# Altium schematic sheet STM32.SchDoc
size 304 x 190 mm; Engineer: Morgan Jones; Revision: 1.0; SheetNumber: 3; SheetTotal: 3
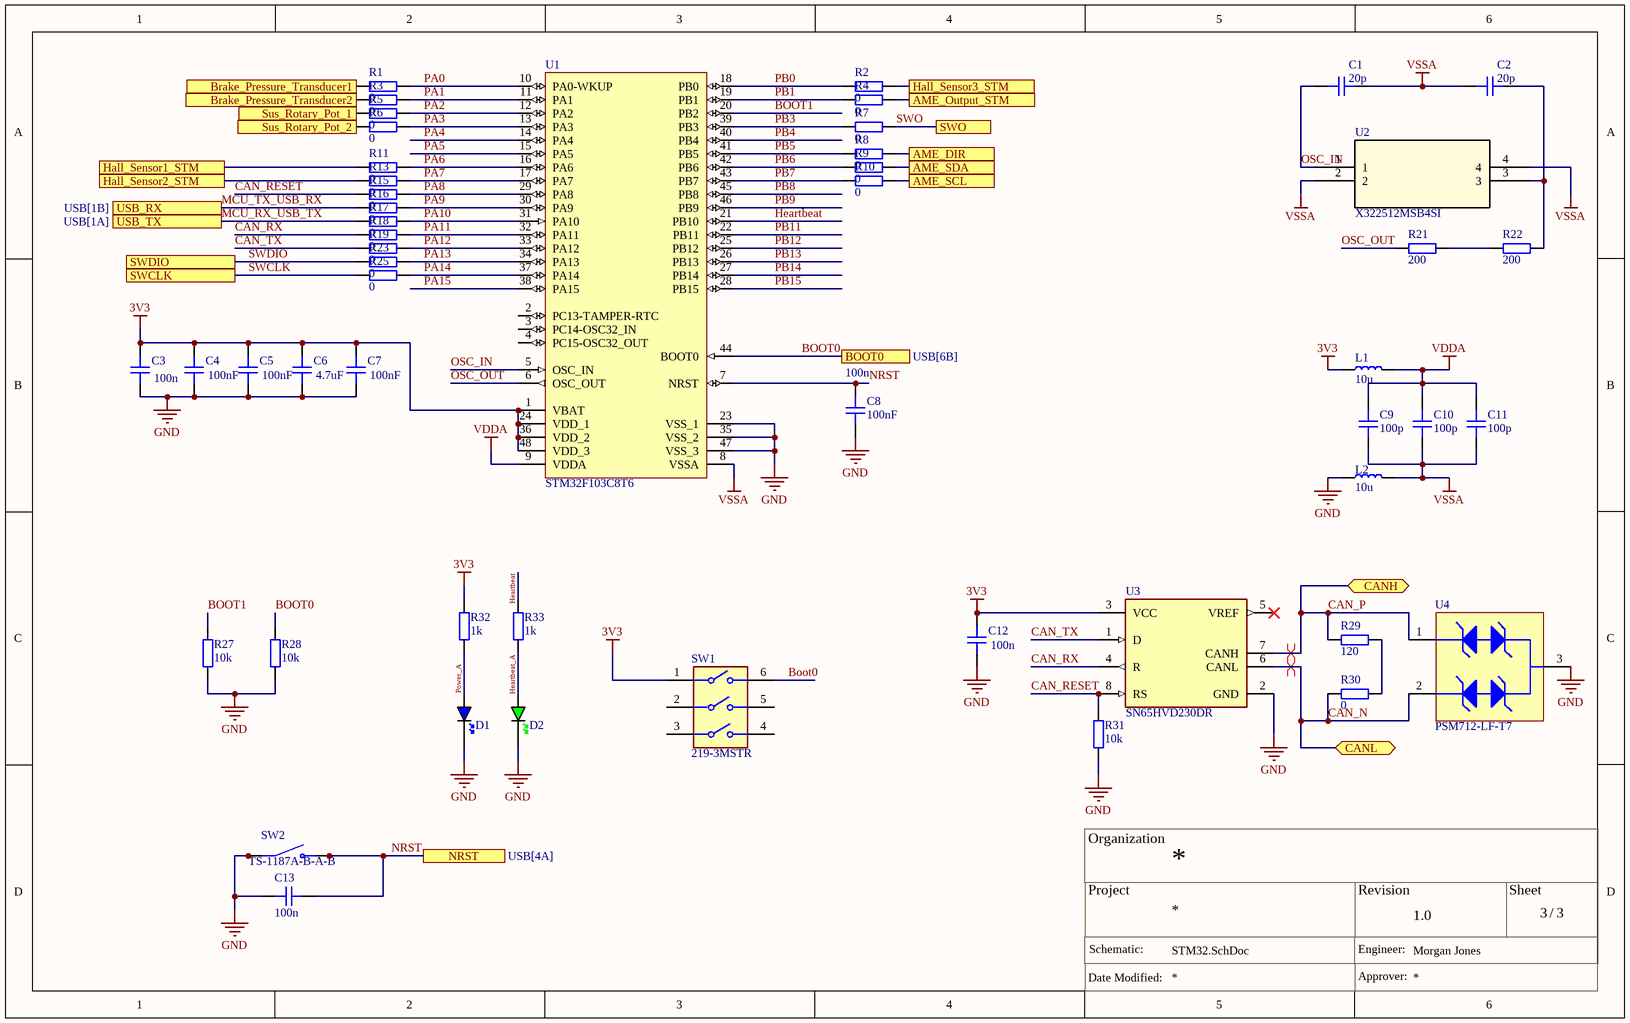
[diagram p0: STM32.SchDoc]

## Parts
C1  20p  [CAP_0402]
C2  20p  [CAP_0402]
C3  100n  [CAP_0402]
C4  Capacitance: 100nF  [CAP_0402]  (hidden comment: 100n)
C5  Capacitance: 100nF  [CAP_0402]  (hidden comment: 100n)
C6  Capacitance: 4.7uF  [CAP_0402]  (hidden comment: 4.7u)
C7  Capacitance: 100nF  [CAP_0402]  (hidden comment: 100n)
C8  100n  Capacitance: 100nF  [CAP_0402]
C9  100p  [CAP_0402]
C10  100p  [CAP_0402]
C11  100p  [CAP_0402]
C12  100n  [CAP_0402]
C13  100n  [CAP_0402]
D1  BLUE  [LED_0603_BLUE]  (value not drawn)
D2  GREEN  [LED_0603_GREEN]  (value not drawn)
L1  10u  [IND_0603]
L2  10u  [IND_0603]
R1  0  [RES_0402]
R2  0  [RES_0402]
R3  0  [RES_0402]
R4  0  [RES_0402]
R5  0  [RES_0402]
R6  0  [RES_0402]
R7  0  [RES_0402]
R8  0  [RES_0402]
R9  0  [RES_0402]
R10  0  [RES_0402]
R11  0  [RES_0402]
R13  0  [RES_0402]
R15  0  [RES_0402]
R16  0  [RES_0402]
R17  0  [RES_0402]
R18  0  [RES_0402]
R19  0  [RES_0402]
R21  200  [RES_0402]
R22  200  [RES_0402]
R23  0  [RES_0402]
R25  0  [RES_0402]
R27  10k  [RES_0402]
R28  10k  [RES_0402]
R29  120  [RES_0402]
R30  0  [RES_0402]
R31  10k  [RES_0402]
R32  1k  [RES_0402]
R33  1k  [RES_0402]
SW1  219-3MSTR  [FP-219-3MSTR-MFG]
SW2  TS-1187A-B-A-B  [SW_TS-1187A-B-A-B]
U1  STM32F103C8T6  [STM-LQFP48_M]
U2  X322512MSB4SI  [XTAL_3225]
U3  SN65HVD230DR  [FP-D0008A-IPC_A]
U4  PSM712-LF-T7  [PRKT-SOT23-3_V]

## Ports
AME_DIR, AME_Output_STM, AME_SCL, AME_SDA, BOOT0 (see USB[6B]), Brake_Pressure_Transducer1, Brake_Pressure_Transducer2, CANH (bidir), CANL (bidir), Hall_Sensor1_STM, Hall_Sensor2_STM, Hall_Sensor3_STM, NRST (see USB[4A]), Sus_Rotary_Pot_1, Sus_Rotary_Pot_2, SWCLK, SWDIO, SWO, USB_RX (see USB[1B]), USB_TX (see USB[1A])

## Nets
3V3: C3.2 C4.2 C5.1 C6.2 C7.2 C12.2 L1.1 R32.1 SW1.1 U1.1(VBAT) U1.24(VDD_1) U1.36(VDD_2) U1.48(VDD_3) U3.3(VCC)
GND: C3.1 C4.1 C5.2 C6.1 C7.1 C8.1 C12.1 C13.1 D1.K D2.K L2.1 R27.2 R28.2 R31.1 SW2.A(COM) SW2.B(COM) U1.23(VSS_1) U1.35(VSS_2) U1.47(VSS_3) U3.2(GND) U4.3
VDDA: C9.2 C10.2 C11.2 L1.2 U1.9(VDDA)
VSSA: C1.2 C2.1 C9.1 C10.1 C11.1 L2.2 U1.8(VSSA) U2.2 U2.4
AME_DIR: R8.1 ; port AME_DIR
AME_Output_STM: R4.2 ; port AME_Output_STM
AME_SCL: R10.1 ; port AME_SCL
AME_SDA: R9.1 ; port AME_SDA
BOOT0: R28.1 SW1.6 U1.44(BOOT0) ; port BOOT0
BOOT1: R27.1 U1.20(PB2)
Brake_Pressure_Transducer1: R1.1 ; port Brake_Pressure_Transducer1
Brake_Pressure_Transducer2: R3.1 ; port Brake_Pressure_Transducer2
CAN_N: R30.1 U3.6(CANL) U4.2 ; port CANL
CAN_P: R29.2 U3.7(CANH) U4.1 ; port CANH
CAN_RESET: R15.2 R31.2 U3.8(RS)
CAN_RX: R18.2 U3.4(R)
CAN_TX: R19.2 U3.1(D)
Hall_Sensor1_STM: R11.2 ; port Hall_Sensor1_STM
Hall_Sensor2_STM: R13.2 ; port Hall_Sensor2_STM
Hall_Sensor3_STM: R2.2 ; port Hall_Sensor3_STM
Heartbeat: R33.1 U1.21(PB10)
Heartbeat_A: D2.A R33.2
MCU_RX_USB_TX: R17.2 ; port USB_TX
MCU_TX_USB_RX: R16.2 ; port USB_RX
NRST: C8.2 C13.2 SW2.C(NO) SW2.D(NO) U1.7(NRST) ; port NRST
OSC_IN: C1.1 U1.5(OSC_IN) U2.1
OSC_OUT: R21.2 U1.6(OSC_OUT)
PA0: R1.2 U1.10(PA0-WKUP)
PA1: R3.2 U1.11(PA1)
PA2: R5.1 U1.12(PA2)
PA3: R6.2 U1.13(PA3)
PA4: U1.14(PA4)
PA5: U1.15(PA5)
PA6: R11.1 U1.16(PA6)
PA7: R13.1 U1.17(PA7)
PA8: R15.1 U1.29(PA8)
PA9: R16.1 U1.30(PA9)
PA10: R17.1 U1.31(PA10)
PA11: R18.1 U1.32(PA11)
PA12: R19.1 U1.33(PA12)
PA13: R23.1 U1.34(PA13)
PA14: R25.1 U1.37(PA14)
PA15: U1.38(PA15)
PB0: R2.1 U1.18(PB0)
PB1: R4.1 U1.19(PB1)
PB3: R7.1 U1.39(PB3)
PB4: U1.40(PB4)
PB5: R8.2 U1.41(PB5)
PB6: R9.2 U1.42(PB6)
PB7: R10.2 U1.43(PB7)
PB8: U1.45(PB8)
PB9: U1.46(PB9)
PB11: U1.22(PB11)
PB12: U1.25(PB12)
PB13: U1.26(PB13)
PB14: U1.27(PB14)
PB15: U1.28(PB15)
Power_A: D1.A R32.2
Sus_Rotary_Pot_1: R5.2 ; port Sus_Rotary_Pot_1
Sus_Rotary_Pot_2: R6.1 ; port Sus_Rotary_Pot_2
SWCLK: R25.2 ; port SWCLK
SWDIO: R23.2 ; port SWDIO
SWO: R7.2 ; port SWO
NetC2_2: C2.2 R22.2 U2.3
NetR21_1: R21.1 R22.1
NetR29_1: R29.1 R30.2

Not connected (* = marked no-connect by the designer): SW1 2 3 4 5; U1 2(PC13-TAMPER-RTC) 3(PC14-OSC32_IN) 4(PC15-OSC32_OUT); U3 5(VREF)*

## Layout directives
differential pair; differential pair class DIFF_CAN: CAN_N, CAN_P

## Notes on the sheet
- Organization
- Project
- Revision
- Sheet
- Schematic:
- Engineer:
- /
- Date Modified:
- Approver:

## Library data of the parts
C1 C2 C4-C11 C13 = CAP_0402: Capacitor SMD 0402; Manufacturer: *; Manufacturer Part Number: *; Distributor Link: *; Rating: *; Dielectric: *
  C1 C2: LCSC Part #: C1554; Capacitance: 20p
  C4 C5 C7 C8 C13: LCSC Part #: C307331
  C6: LCSC Part #: C23733
  C9-C11: LCSC Part #: C1546
C3 C12 = CAP_0402: Capacitor SMD 0402; Capacitance: 100nF; Manufacturer: *; Manufacturer Part Number: *; Distributor Link: *; LCSC Part #: C307331; Rating: *; Dielectric: *
D1 = LED_0603_BLUE: LED 0603 BLUE SMD; LCSC Part #: C72041
D2 = LED_0603_GREEN: LED 0603 GREEN SMD; LCSC Part #: C72043
L1 L2 = IND_0603: Inductor SMD 0603; LCSC Part #: C1035
R1-R11 R13 R15-R19 R21-R23 R25 R27-R33 = RES_0402: Resistor SMD 0402; Manufacturer: *; Manufacturer Part Number: *; Distributor Link: *
  R1-R11 R13 R15-R19 R23 R25: LCSC Part #: C17168
  R21 R22: LCSC Part #: C25087
  R27 R28: LCSC Part #: C25744; Resistance: 10k
  R29: LCSC Part #: C25079; Resistance: 120
  R30: LCSC Part #: C17168; Resistance: 0
  R31: LCSC Part #: C25744
  R32 R33: LCSC Part #: C11702
SW1 = CMP-07018-000004-1: SWITCH SLIDE DIP SPST 100MA 20V; Washable: Yes; Mechanical Life: 2000Cycles; Number of Positions: 3; Pitch: 0.1inch; Actuator Type: Slide (Standard); Max Operating Temperature: 85°C; Voltage Rating (DC): 20V; Termination: Gull Wing; Length: 0.358inch; Min Operating Temperature: -55°C; Orientation: Straight; Mount: Surface Mount; Package Quantity: 1000; Current Rating: 100mA; Electrical Life: 2000Cycles; Max Current Rating: 100mA; Throw Configuration: SPST; Contact Material: Copper; Packaging: Tape and Reel; Contact Plating: Gold; Lead Free: Lead Free; Max Voltage Rating (DC): 20V; LCSC Part #: C3012353
SW2 = TS-1187A-B-A-B: SPST 50mA @ 12VDC Top Actuated Round Button 160gf SMD Tactile Switches RoHS; MP: TS-1187A-B-A-B; Value: *; Price: None; Package: None; Availability: Unavailable; LCSC Part #: C318884
U1 = CMP-0237-00303-2: ARM Cortex-M3 32-bit MCU, 64 KB Flash, 20 KB Internal RAM, 37 I/Os, 48-Pin LQFP, -40 to 105 degC, Tape and Reel; Manufacturer: STMicroelectronics; PartNumber: STM32F103C8T7TR; Operating Frequency(F) (Processor speed) (MHz): 72; Supply Voltage(Vcc) min (V): 2; FLASH Size (Prog) (kB): 64; Internal RAM Size (kB): 20; I/Os (High Current): 36; Package Reference: LQFP48; ComponentLink2Description: Datasheet; ComponentLink2URL: http://www.st.com/st-web-ui/static/active/en/resource/technical/document/datasheet/CD00161566.pdf; ComponentLink1URL: http://www.st.com/; Packing: Tape and Reel; ComponentLink1Description: Manufacturer URL; DatasheetVersion: Rev. 17; Core: ARM Cortex-M3; Mounting Technology: Surface Mount; Package Description: 48-Pin Low Profile Quad Flat Package, Body 7 x 7 mm, Pitch 0.5 mm; LCSC Part #: C8734
U2 = X322512MSB4SI: No Description Available; Mfr_Name: YXC; Copyright: Copyright (C) 2023 Ultra Librarian. All rights reserved.; Manufacturer_Part_Number: X322512MSB4SI; RefDes: RefDes; Type: DEV; LCSC Part #: C9002
U3 = CMP-0315-00015-3: IC TRANSCEIVER HALF 1/1 8SOIC; Number of Transceivers: 1; Operating Supply Voltage: 3.3V; Number of I/Os: 2; Max Supply Current: 17mA; Max Supply Voltage: 3.6V; Min Supply Voltage: 3V; Data Rate: 1Mbps; Min Operating Temperature: -40°C; Packaging: Tape and Reel; Lead Free: Lead Free; Number of Transmit Buffers: 1; Max Operating Temperature: 85°C; Number of Receive Buffers: 1; Number of Pins: 8; Package Quantity: 1; Radiation Hardening: No; Case/Package: D; REACH SVHC: No SVHC; Weight: 0.002561oz; Termination: SMD/SMT; Contact Plating: Gold; Nominal Supply Current: 17mA; Number of Receivers: 1; Number of Drivers: 1; LCSC Part #: C5342107
U4 = CMP-2000-07553-1: TVS Array - Asymmetrical Data Line Protector, 600 W, 7.5 V, -55 to 150 degC, 3-Pin SOT23, RoHS, Tape and Reel; Manufacturer: Protek Devices; Min Breakdown Voltage: 7.5V; Direction: Bidirectional; Capacitance: 75pF; Current: 20uA; Power Dissipation: 600W; Working Voltage: 7V; Voltage: 12V; Case\/Package: SOT-23; Clamping Voltage: 17V; Element Configuration: Dual; Mounting Technology: SurfaceMount; RoHSCompliant: True; Radiation Hardening: No; Depth: 1.4mm; Lead Free: LeadFree; Package Description: 3-Pin Small Outline Transistor, Body 2.92 x 1.3 mm, Pitch 0.94 mm; Max Operating Temperature: 150degC; Length: 3.04mm; Manufacturer URL: http://www.protekdevices.com/; Min Operating Temperature: -55degC; Leakage Current: 20uA; Datasheet URL: www.protekdevices.com/xyz/documents/datasheets/psm712.pdf; Packaging: TapeandReel; Datasheet Version: 10/2013; Package Reference: SOT23-3; Number of Pins: 3; LCSC Part #: C32677